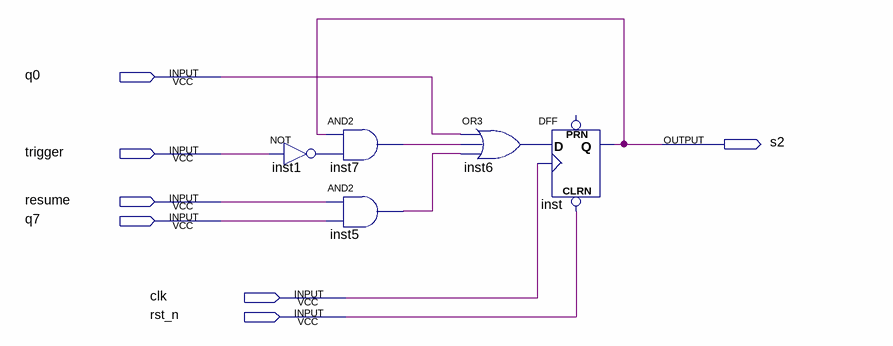
[diagram p0: schematic sheet]
// Quartus schematic s2.bdf as structural Verilog: 5 symbols, 7 pins
module s2 (
  input  q0,
  input  trigger,
  input  resume,
  input  q7,
  input  clk,
  input  rst_n,
  output s2
);

  wire inst1_out, inst5_out, inst6_out, inst7_out;

  not inst1 (inst1_out, trigger);
  and inst7 (inst7_out, s2, inst1_out);
  and inst5 (inst5_out, resume, q7);
  or inst6 (inst6_out, q0, inst7_out, inst5_out);
  DFF inst (.CLRN(rst_n), .CLK(clk), .D(inst6_out), .Q(s2));  // open: PRN
endmodule
